# Altium schematic sheet EEPROM.SchDoc: I2C EEprom
size 292 x 193 mm; DocumentNumber: 53; SheetNumber: 42; SheetTotal: 44
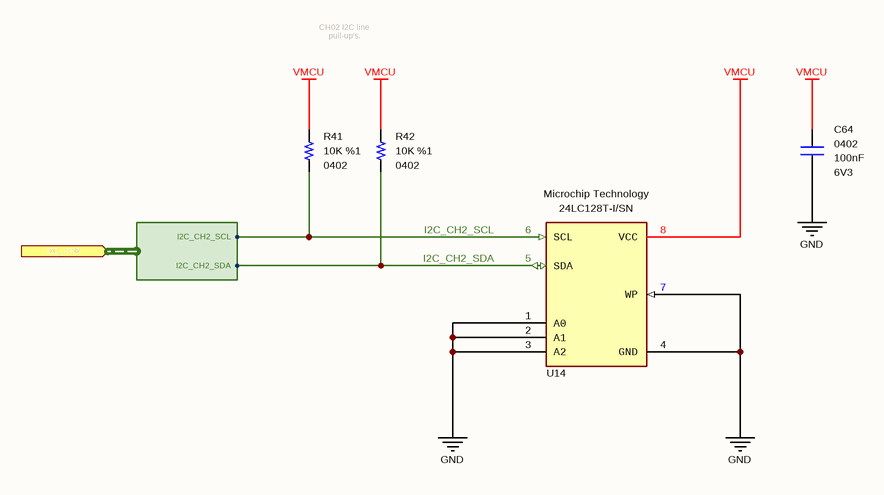
[diagram p0: EEPROM.SchDoc]

## Parts
C64  value 100nF  Case: 0402  Voltage: 6V3  [CAPACITOR_0402]  (hidden comment: Multilayer Ceramic Capacitor)
R41  value 10K  Tolerance: %1  Case: 0402  [RESISTOR_0402]  (hidden comment: Thick Film Resistor)
R42  value 10K  Tolerance: %1  Case: 0402  [RESISTOR_0402]  (hidden comment: Thick Film Resistor)
U14  Manufacturer Part Number: 24LC128T-I/SN  Manufacturer Name: Microchip Technology  [SOIC-8]  (hidden comment: EEPROM)

## Ports
I2C_CH2 (in, harness I2C_CH2)

## Harnesses
I2C_CH2: I2C_CH2_SDA, I2C_CH2_SCL

## Nets
GND: C64.1 U14.1(A0) U14.2(A1) U14.3(A2) U14.4(GND) U14.7(WP)
VMCU: C64.2 R41.2 R42.2 U14.8(VCC)
I2C_CH2_SCL: R41.1 U14.6(SCL) ; port I2C_CH2.I2C_CH2_SCL
I2C_CH2_SDA: R42.1 U14.5(SDA) ; port I2C_CH2.I2C_CH2_SDA

## Notes on the sheet
- CH02 I2C line pull-up's.
- © 2021 All rights reserved.
  This document may not, in whole or in part, be copied, photocopied, reproduced, translated or converted to any electronic or machine readable from without prior written permission of Mehmet Günce Akkoyun.
  Engineer contact : akkoyun@me.com
- Property of
- Engineer :
- Date :
- Size :
- A4
- Time :
- Project :
- Page :
- /
- Customer :
- Product ID :
- Module ID :
- Version :
- File :
- Revision :

## Library data of the parts
C64 = Capacitor - 100nF [0402-6V3]: Capacitor - 100nF [0402-6V3] (Ceramic); Manufacturer Name: AVX; Manufacturer Part Number: 04026D104KAT4A; Dielectric: X5R; Tolerance: %10; Height: 0.25mm; ComponentLink1Description: Mouser; ComponentLink1URL: https://www.mouser.com.tr/ProductDetail/AVX/04026D104KAT4A?qs=sGAEpiMZZMs0AnBnWHyRQPg4iYkCw7IMED%2F4kpqgf7w%3D; ComponentLink2Description: DataSheet; ComponentLink2URL: https://www.mouser.com.tr/datasheet/2/40/cx5r-776519.pdf; ROHS: Yes; Maximum Operating Temperature: +85; Minimum Operating Temperature: -55; Supplier 1: Avnet; Supplier Part Number 1: 04026D104KAT4A; Mouser Part Number: 581-04026D104KAT4A
R41 R42 = Resistor - 10K: Thick Film Resistors - SMD 1/16 W 10 Kohms 1%; Manufacturer Name: Vishay; Manufacturer Part Number: CRCW040210K0FKED; Height: 0.4mm; ComponentLink1Description: DataSheet; ComponentLink1URL: https://www.mouser.com.tr/datasheet/2/427/dcrcwe3-1762152.pdf; ComponentLink2Description: Mouser; ComponentLink2URL: https://www.mouser.com.tr/ProductDetail/Vishay-Dale/CRCW040210K0FKED?qs=sGAEpiMZZMu61qfTUdNhG2DpbjADlD3GcalbOv9utCY%3D; Supplier 1: Mouser; Supplier 2: Digi-Key; Supplier Part Number 1: 71-CRCW040210K0FKEDH; Supplier Part Number 2: 541-10.0KYCT-ND; Mouser Part Number: 71-CRCW0402-10K-E3
U14 = IC - 24LC128: Case: SOIC-8; RoHS: Yes; ComponentLink1Description: DataSheet; ComponentLink1URL: https://www.mouser.com.tr/datasheet/2/256/DS28CM00-1514106.pdf; ComponentLink2Description: Mouser; ComponentLink2URL: https://www.mouser.com.tr/ProductDetail/Maxim-Integrated/DS28CM00R-A00%2bT/?qs=0Y9aZN%252BMVCUcpogu0Fss%2Fg%3D%3D; Mouser Part Number: 579-24LC128T-I/SN; Supplier 1: Avnet; Supplier 2: Future Electronics; Supplier 3: Arrow Electronics; Supplier 4: Mouser; Supplier 5: Farnell; Supplier 6: Newark; Supplier 7: Digi-Key; Supplier 8: Digi-Key; Supplier Part Number 1: 24LC128T-I/SN; Supplier Part Number 2: 4391603; Supplier Part Number 3: 24LC128T-I/SN; Supplier Part Number 4: 579-24LC128T-I/SN; Supplier Part Number 5: 1296574; Supplier Part Number 6: 25M1950; Supplier Part Number 7: 24LC128T-I/SNCT-ND; Supplier Part Number 8: 24LC128T-I/SNDKR-ND